# EAGLE design 32pinromtoflash (EAGLE 9.6.2)
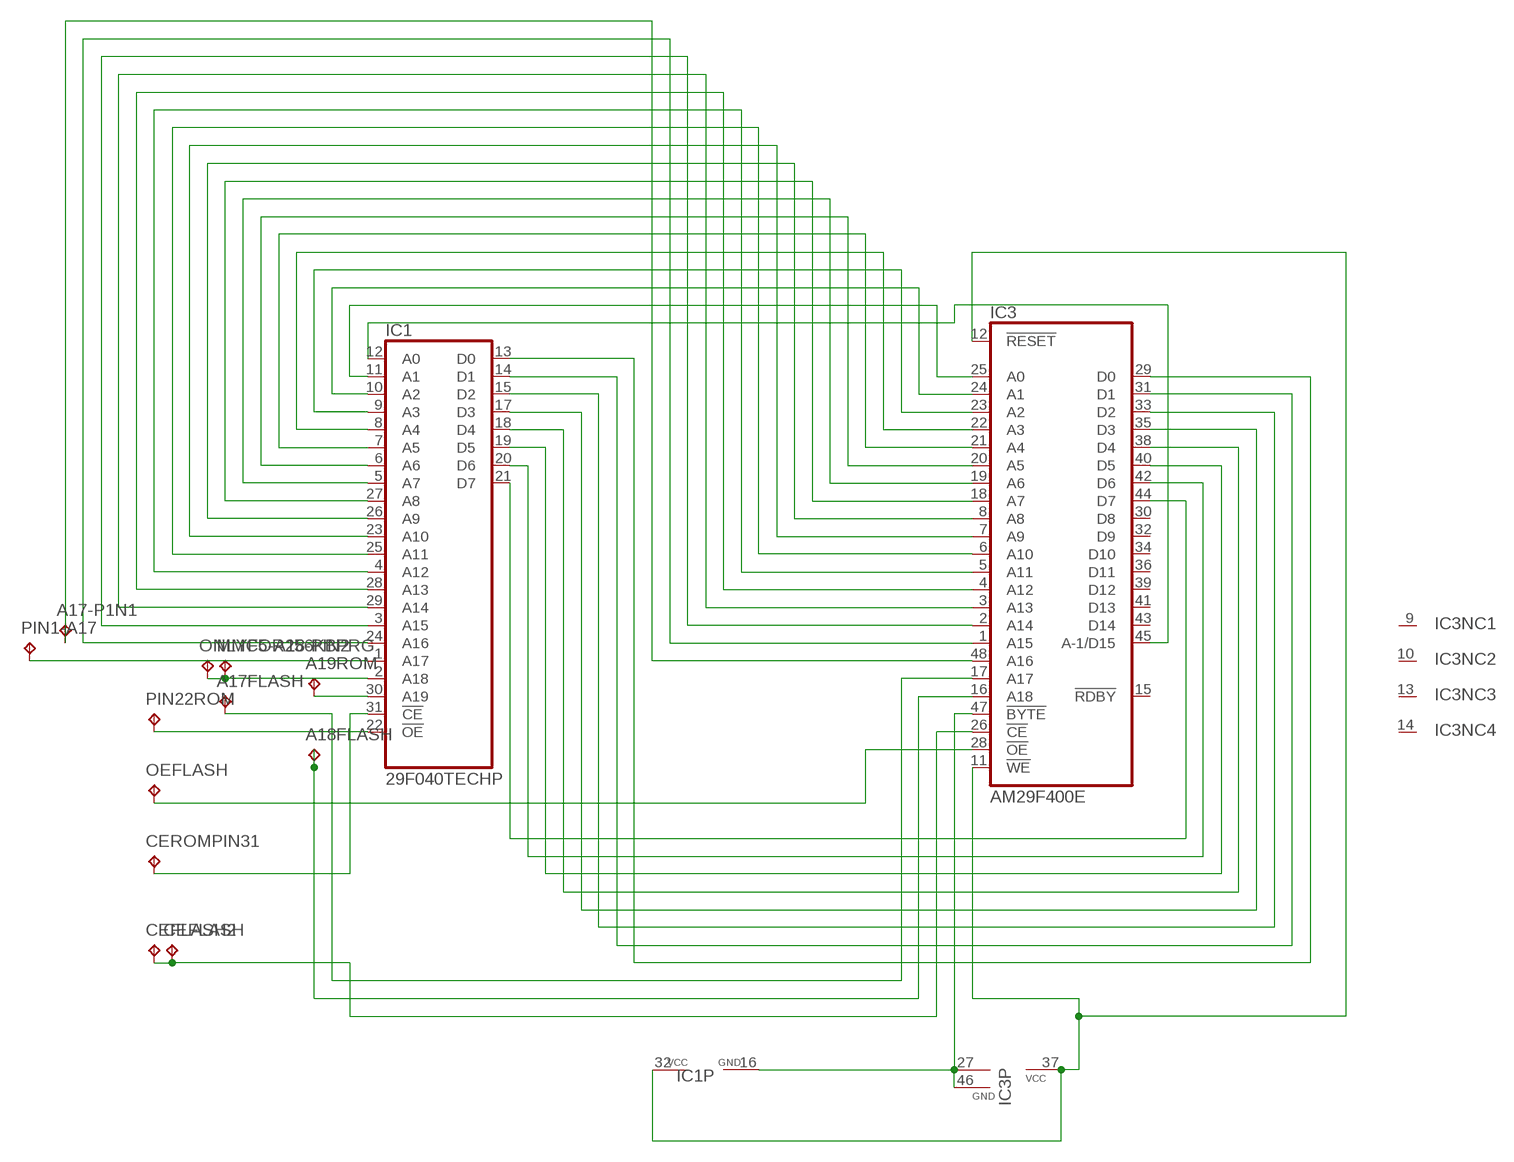
[diagram p0: schematic, sheet 1]

## Parts
A17-P1N1  TPTP07SQ  [TP07SQ]
A17FLASH  TPTP07SQ  [TP07SQ]
A18FLASH  TPTP07SQ  [TP07SQ]
A19ROM  TPTP07SQ  [TP07SQ]
CEFLASH  TPTP07SQ  [TP07SQ]
CEFLASH2  TPTP07SQ  [TP07SQ]
CEROMPIN31  TPTP07SQ  [TP07SQ]
IC1  29F040TECHP  [DIL32-3]
IC3  AM29F400E  [TSOP48]
MMC5-A18-PIN2  TPTP07SQ  [TP07SQ]
OEFLASH  TPTP07SQ  [TP07SQ]
ONLYFOR256KBPRG  TPTP07SQ  [TP07SQ]
PIN1-A17  TPTP07SQ  [TP07SQ]
PIN22ROM  TPTP07SQ  [TP07SQ]

## Nets
A17FLASH: A17FLASH.TP IC3.17(A17)
CEFLASH: CEFLASH2.TP CEFLASH.TP IC3.26(!CE)
CEROMPIN31: CEROMPIN31.TP IC1.31(!CE)
FLASH-A18: A18FLASH.TP IC3.16(A18)
MMC5-A0: IC1.12(A0) IC3.45(A-1/D15)
MMC5-A1: IC1.11(A1) IC3.25(A0)
MMC5-A2: IC1.10(A2) IC3.24(A1)
MMC5-A3: IC1.9(A3) IC3.23(A2)
MMC5-A4: IC1.8(A4) IC3.22(A3)
MMC5-A5: IC1.7(A5) IC3.21(A4)
MMC5-A6: IC1.6(A6) IC3.20(A5)
MMC5-A7: IC1.5(A7) IC3.19(A6)
MMC5-A8: IC1.27(A8) IC3.18(A7)
MMC5-A9: IC1.26(A9) IC3.8(A8)
MMC5-A10: IC1.23(A10) IC3.7(A9)
MMC5-A11: IC1.25(A11) IC3.6(A10)
MMC5-A12: IC1.4(A12) IC3.5(A11)
MMC5-A13: IC1.28(A13) IC3.4(A12)
MMC5-A14: IC1.29(A14) IC3.3(A13)
MMC5-A15: IC1.3(A15) IC3.2(A14)
MMC5-A16: IC1.24(A16) IC3.1(A15)
MMC5-A17: A17-P1N1.TP IC3.48(A16)
MMC5-A19: A19ROM.TP IC1.30(A19)
MMC5-D0: IC1.13(D0) IC3.29(D0)
MMC5-D1: IC1.14(D1) IC3.31(D1)
MMC5-D2: IC1.15(D2) IC3.33(D2)
MMC5-D3: IC1.17(D3) IC3.35(D3)
MMC5-D4: IC1.18(D4) IC3.38(D4)
MMC5-D5: IC1.19(D5) IC3.40(D5)
MMC5-D6: IC1.20(D6) IC3.42(D6)
MMC5-D7: IC1.21(D7) IC3.44(D7)
MMC5-VCC: IC1.32(VCC) IC3.11(!WE) IC3.12(!RESET) IC3.37(VCC)
MMC5-VSS: IC1.16(GND) IC3.27(GND) IC3.46(GND) IC3.47(!BYTE)
N$1: IC1.1(A17) PIN1-A17.TP
OEFLASH: IC3.28(!OE) OEFLASH.TP
PIN2ROM: IC1.2(A18) MMC5-A18-PIN2.TP ONLYFOR256KBPRG.TP
PIN22ROM: IC1.22(!OE) PIN22ROM.TP
Unconnected: IC3.9(NC) IC3.10(NC) IC3.13(NC) IC3.14(NC) IC3.15(!RDBY) IC3.30(D8) IC3.32(D9) IC3.34(D10) IC3.36(D11) IC3.39(D12) IC3.41(D13) IC3.43(D14)

## Library data of the parts
A17-P1N1 A17FLASH A18FLASH A19ROM CEFLASH CEFLASH2 CEROMPIN31 MMC5-A18-PIN2 OEFLASH ONLYFOR256KBPRG PIN1-A17 PIN22ROM = testpad:TP: Test pad
IC1 = MMC5:29F040: mmc5 rom
IC3 = custom 8-megabit am29-memory:AM29F400E: 4-Megabit FLASH MEMORY (512 K x 8 bit/256 K x 16 bit) 5 V-only

## Board
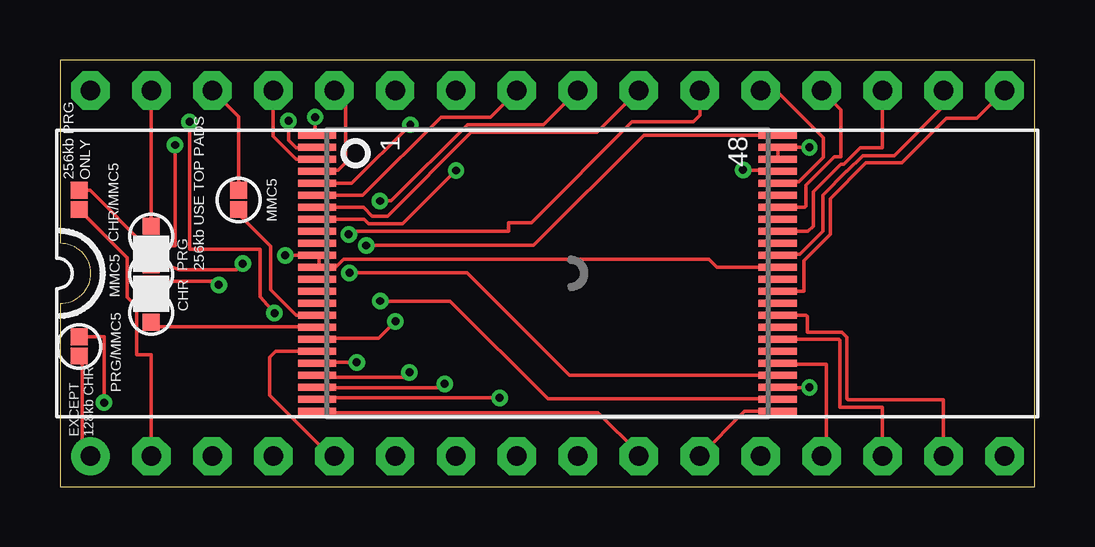
[diagram p1: board, top side]
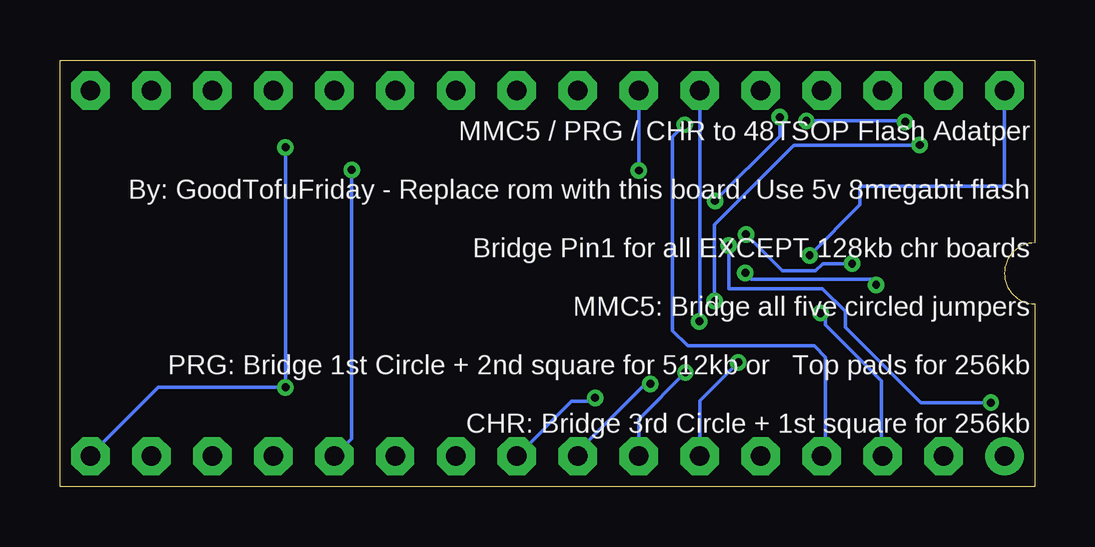
[diagram p2: board, bottom side, seen from below]

Size 40.64 x 17.78 mm. Coordinates in mm from the lower left corner, seen from the top.
Outline: 0,17.78 0,10.16 arc-180 0,7.62 0,0 40.64,0 40.64,17.78 0,17.78
Copper layers (1*16): Top 0.0356mm / dielectric 1.5011mm / Bottom 0.0356mm
Design rules "oshpark-2layer": minimum track width 6mil, minimum drill 13mil, track to track 6mil, track to pad 6mil, pad to pad 6mil, via to via 6mil, smd to smd 6mil, copper to edge 15mil, drill to drill 6mil, minimum pad ring 7mil, minimum via ring 7mil, stop-mask expansion 4mil, vias tented up to drill 0mil, thermal gap 10mil

### Footprints (pad centres in the part's own frame; a part is rotated, then mirrored left to right if it is on the bottom)
TP07SQ = smd 0.7 x 0.7: TP 0,0
DIL32-3 = drill 0.813 pad 1.6: 1 -19.05,-7.62 | drill 0.813 pad 1.6 octagon: 2 -16.51,-7.62; 3 -13.97,-7.62; 4 -11.43,-7.62; 5 -8.89,-7.62; 6 -6.35,-7.62; 7 -3.81,-7.62; 8 -1.27,-7.62; 9 1.27,-7.62; 10 3.81,-7.62; 11 6.35,-7.62; 12 8.89,-7.62; 13 11.43,-7.62; 14 13.97,-7.62; 15 16.51,-7.62; 16 19.05,-7.62; 17 19.05,7.62; 18 16.51,7.62; 19 13.97,7.62; 20 11.43,7.62; 21 8.89,7.62; 22 6.35,7.62; 23 3.81,7.62; 24 1.27,7.62; 25 -1.27,7.62; 26 -3.81,7.62; 27 -6.35,7.62; 28 -8.89,7.62; 29 -11.43,7.62; 30 -13.97,7.62; 31 -16.51,7.62; 32 -19.05,7.62
TSOP48 = smd 0.3 x 1.6: 1 -5.75,-9.6; 2 -5.25,-9.6; 3 -4.75,-9.6; 4 -4.25,-9.6; 5 -3.75,-9.6; 6 -3.25,-9.6; 7 -2.75,-9.6; 8 -2.25,-9.6; 9 -1.75,-9.6; 10 -1.25,-9.6; 11 -0.75,-9.6; 12 -0.25,-9.6; 13 0.25,-9.6; 14 0.75,-9.6; 15 1.25,-9.6; 16 1.75,-9.6; 17 2.25,-9.6; 18 2.75,-9.6; 19 3.25,-9.6; 20 3.75,-9.6; 21 4.25,-9.6; 22 4.75,-9.6; 23 5.25,-9.6; 24 5.75,-9.6; 25 5.75,9.6; 26 5.25,9.6; 27 4.75,9.6; 28 4.25,9.6; 29 3.75,9.6; 30 3.25,9.6; 31 2.75,9.6; 32 2.25,9.6; 33 1.75,9.6; 34 1.25,9.6; 35 0.75,9.6; 36 0.25,9.6; 37 -0.25,9.6; 38 -0.75,9.6; 39 -1.25,9.6; 40 -1.75,9.6; 41 -2.25,9.6; 42 -2.75,9.6; 43 -3.25,9.6; 44 -3.75,9.6; 45 -4.25,9.6; 46 -4.75,9.6; 47 -5.25,9.6; 48 -5.75,9.6

### Placement (x,y rotation side)
A17-P1N1  0.8,6.25 0 top
A17FLASH  3.8,6.85 0 top
A18FLASH  7.45,11.55 0 top
A19ROM  7.45,12.35 0 top
CEFLASH  3.8,10.05 0 top
CEFLASH2  0.8,12.35 0 top
CEROMPIN31  3.8,10.85 0 top
IC1  20.32,8.89 0 top
IC3  20.32,8.89 270 top
MMC5-A18-PIN2  3.8,7.65 0 top
OEFLASH  3.8,8.45 0 top
ONLYFOR256KBPRG  0.8,11.55 0 top
PIN1-A17  0.8,5.45 0 top
PIN22ROM  3.8,9.25 0 top

### Tracks (layer width: path | path; a pad name or v marks a point on that pad's centre or on a via)
A17FLASH
  Top 0.152: 3.81,6.81 3.8,6.82 A17FLASH.TP 3.81,6.96 3.81,6.66 10.67,6.66 IC3.17
CEFLASH  (via drill 0.33)
  Top 0.152: v13.35,7.74 16.26,7.74 20.34,3.66 29.45,3.66 29.47,3.64 IC3.26 | v4.8,14.24 4.8,10.05 CEFLASH.TP 3.55,10.05 1.25,12.35 CEFLASH2.TP
  Bottom 0.152: v13.35,7.74 13.35,10.91 10.04,14.22 4.88,14.22 | 4.88,14.22 4.81,14.22 | v4.8,14.24 4.88,14.17 4.88,14.22
CEROMPIN31
  Top 0.152: IC1.31 CEROMPIN31.TP
FLASH-A18
  Top 0.152: A18FLASH.TP 7.45,11.35 8.79,10.01 8.79,8.2 9.84,7.14 10.64,7.14 IC3.16
MMC5-A0  (via drill 0.33)
  Top 0.152: 30.02,13.11 IC3.45 29.84,13.18 28.5,13.18 v28.48,13.2
  Bottom 0.152: v28.48,13.2 28.48,2 IC1.12
MMC5-A1
  Top 0.152: IC3.25 28.54,3.14 IC1.11
MMC5-A2
  Top 0.152: 10.67,3.2 IC3.24 10.77,3.09 22.43,3.09 24.13,1.39 IC1.10
MMC5-A3  (via drill 0.33)
  Top 0.152: 10.82,3.66 IC3.23 11.13,3.7 v18.33,3.7
  Bottom 0.152: v18.33,3.7 18.48,3.55 19.31,3.55 IC1.9
MMC5-A4  (via drill 0.33)
  Top 0.152: 10.82,4.12 IC3.22 10.79,4.13 15.88,4.13 v16.03,4.29
  Bottom 0.152: v16.03,4.29 16.23,4.29 19.05,1.47 IC1.8
MMC5-A5  (via drill 0.33)
  Top 0.152: v14.57,4.76 14.36,4.55 10.9,4.55 IC3.21
  Bottom 0.152: IC1.7 16.51,2.82 v14.57,4.76
MMC5-A6  (via drill 0.33)
  Top 0.152: v12.37,5.18 10.76,5.18 IC3.20
  Bottom 0.152: v12.37,5.18 13.97,3.58 IC1.6
MMC5-A7
  Top 0.152: 10.67,5.64 IC3.19 9.61,5.64 9.6,5.65 8.98,5.65 8.73,5.4 8.73,3.81 11.27,1.27 IC1.5
MMC5-A8  (via drill 0.33)
  Top 0.152: v13.98,6.89 13.29,6.19 10.79,6.19 IC3.18
  Bottom 0.152: v13.98,6.89 13.97,6.9 IC1.27
MMC5-A9  (via drill 0.33)
  Top 0.152: 10.82,11.12 IC3.8 12.67,11.14 12.86,10.95 14.29,10.95 v16.51,13.18
  Bottom 0.152: IC1.26 v16.51,13.18
MMC5-A10
  Top 0.152: 10.67,11.58 IC3.7 12.65,11.64 13.02,11.27 13.65,11.27 17.14,14.76 22.38,14.76 IC1.23
MMC5-A11
  Top 0.152: 10.82,12.19 IC3.6 | IC1.25 17.94,15.4 15.88,15.4 12.62,12.14 IC3.6 | 10.79,12.22 IC3.6
MMC5-A12  (via drill 0.33)
  Top 0.152: 10.67,12.65 IC3.5 12.16,12.64 v14.61,15.08
  Bottom 0.152: v14.61,15.08 15.11,14.58 15.11,6.5 14.46,5.87 9.2,5.87 8.73,5.4 8.73,1.43 IC1.4
MMC5-A13
  Top 0.152: IC1.28 11.91,16.03 11.91,13.49 11.59,13.18 10.79,13.18 IC3.4
MMC5-A14
  Top 0.152: IC1.29 8.89,14.61 9.84,13.65 10.64,13.65 IC3.3
MMC5-A15  (via drill 0.33)
  Top 0.152: 10.67,14.17 IC3.2 10.64,14.13 9.84,14.13 9.53,14.45 v9.53,15.24 | 5.45,15.15 v5.4,15.21 5.4,9.9 8.33,9.9 8.33,7.91 v8.94,7.23 | IC1.3 6.5,1.42
  Bottom 0.152: v9.53,15.24 5.4,15.24 v5.4,15.21 | v8.94,7.23 8.94,7.18 8.73,7.06 8.73,6.76 6.4,4.42 6.4,1.37 IC1.3
MMC5-A16  (via drill 0.33)
  Top 0.152: v10.64,15.4 10.64,14.76 IC3.1 | v13.34,11.91 13.81,11.91 16.99,15.08 20.16,15.08 IC1.24
  Bottom 0.152: v10.64,15.4 10.64,14.61 v13.34,11.91
MMC5-A17  (via drill 0.33)
  Top 0.152: 29.87,14.63 IC3.48 29.91,14.65 24.35,14.65 19.75,10.05 v12.77,10.05 | v1.84,3.5 1.84,6.25 A17-P1N1.TP
  Bottom 0.152: v12.77,10.05 12.77,8.25 8.85,8.25 7.9,7.3 7.9,6.65 4.75,3.5 2.35,3.5 v1.84,3.5
MMC5-A19
  Top 0.152: IC1.30 7.45,15.41 A19ROM.TP
MMC5-D0
  Top 0.152: 29.87,5.18 IC3.29 30,5.08 30.5,5.08 30.52,5.1 31.95,5.1 31.95,1.47 IC1.13
MMC5-D1
  Top 0.152: IC1.14 34.29,3.31 32.5,3.31 32.5,6.1 32.46,6.14 IC3.31
MMC5-D2
  Top 0.152: 29.87,7.16 IC3.33 30,7.14 31.1,7.14 31.15,7.09 31.15,6.45 32.59,6.45 32.8,6.23 32.8,3.66 32.85,3.62 36.83,3.62 IC1.15
MMC5-D3
  Top 0.152: IC3.35 31,8.14 31,9.42 32.1,10.52 32.1,12.01 33.59,13.49 35.09,13.49 36.95,15.35 38.21,15.35 IC1.17
MMC5-D4
  Top 0.152: IC1.18 36.83,15.85 34.78,13.8 33.46,13.8 32.8,13.14 32.79,13.14 31.8,12.15 31.8,10.65 30.83,9.68 30,9.68 IC3.38
MMC5-D5
  Top 0.152: 29.87,10.67 IC3.40 30,10.64 31.19,10.64 31.41,10.86 31.41,12.3 32.55,13.45 32.68,13.45 33.36,14.13 34.29,14.13 IC1.19
MMC5-D6
  Top 0.152: 29.87,11.58 IC3.42 31.05,11.64 31.1,11.69 31.1,12.57 32.28,13.75 32.55,13.75 32.55,15.71 IC1.20
MMC5-D7
  Top 0.152: 29.87,12.65 IC3.44 30,12.7 30.8,12.7 31.82,13.73 31.82,14.53 29.84,16.51 IC1.21
MMC5-VCC  (via drill 0.33)
  Top 0.152: IC3.12 10.82,9.14 | 10.82,9.6 IC3.11 | IC3.12 10.79,9.21 10.79,9.56 IC3.11 | 29.84,9.21 IC3.37 27.39,9.14 27.05,9.48 11.83,9.48 11.49,9.14 IC3.12 | IC3.12 | IC3.12 11.39,9.14 | IC3.11 v9.39,9.64
  Bottom 0.152: IC1.32 1.27,12.51 7.29,12.51 7.29,11.74 v9.39,9.64
MMC5-VSS  (via drill 0.33)
  Top 0.152: 30,13.65 IC3.46 IC3.47 | 30,14.13 IC3.47 | 30,4.13 IC3.27 30.02,4.12 31.21,4.12 v31.24,4.14 | IC3.47 v31.24,14.14
  Bottom 0.152: IC1.16 39.32,1.37 36.55,4.14 31.45,4.14 31.39,4.12 31.24,4.12 v31.24,4.14 v31.24,14.14
N$1
  Top 0.152: IC1.1 0.92,1.62 0.92,5.33 PIN1-A17.TP
OEFLASH  (via drill 0.33)
  Top 0.152: IC3.28 21.24,4.64 16.97,8.91 v12.07,8.91 | OEFLASH.TP 3.91,8.56 6.47,8.56 v6.62,8.41
  Bottom 0.152: v12.07,8.91 11.81,8.65 6.71,8.65 | 6.71,8.65 6.7,8.65 | v6.62,8.41 6.62,8.56 6.71,8.65
PIN2ROM
  Top 0.152: IC1.2 3.81,5.5 3.2,5.5 3.2,7.5 3.05,7.65 | 3.05,7.65 MMC5-A18-PIN2.TP | ONLYFOR256KBPRG.TP 2.8,9.55 2.8,7.9 3.05,7.65
PIN22ROM  (via drill 0.33)
  Top 0.152: IC1.22 26.67,15.47 26.4,15.2 23.85,15.2 19.65,11 18.7,11 18.7,10.65 14.41,10.65 12.73,10.65 12.05,10.65 12.04,10.67 v12.04,10.52 | v7.62,9.3 7.37,9.05 4.97,9.05 4.41,9.25 PIN22ROM.TP
  Bottom 0.152: v7.62,9.3 8.84,9.3 9.14,8.99 10.52,8.99 v12.04,10.52

### Text on the board
tNames: 256kb PRG / ONLY | MMC5 | CHR/MMC5 | PRG / 256kb USE TOP PADS | MMC5 | CHR | PRG/MMC5 | EXCEPT / 128kb CHR
bNames: MMC5 / PRG / CHR to 48TSOP Flash Adatper / / By: GoodTofuFriday - Replace rom with this board. Use 5v 8megabit flash / / Bridge Pin1 for all EXCEPT 128kb chr boards / / MMC5: Bridge all five circled jumpers / / PRG: Bridge 1st Circle + 2nd square for 512kb or Top pads for 256kb / / CHR: Bridge 3rd Circle + 1st square for 256kb